# Altium schematic sheet Sheet5.SchDoc
size A4; SheetNumber: 5; SheetTotal: 6
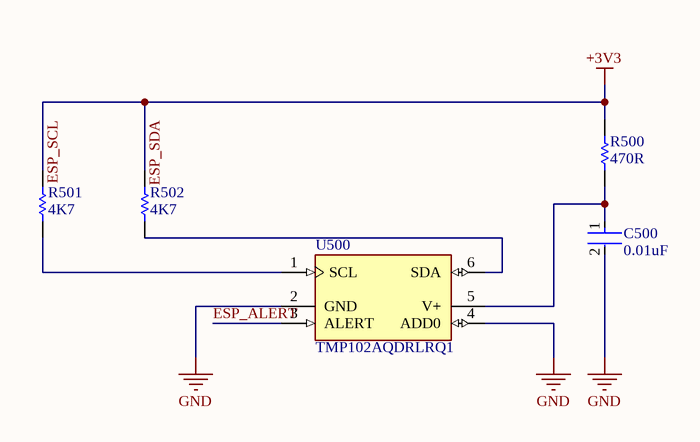
[diagram p0: Sheet5.SchDoc]

## Parts
C500  0.01uF  [FP-GRM155-0_05-IPC_C]
R500  470R  [RESC1005X40X25ML05T10]
R501  4K7  [RESC1005X40X25NL05T10]
R502  4K7  [RESC1005X40X25NL05T10]
U500  TMP102AQDRLRQ1  [FP-DRL0006A-MFG]

## Nets
ESP_SCL: R500.2 R501.2 R502.2  [also labelled +3V3, ESP_SDA]
GND: C500.2 U500.2(GND) U500.4(ADD0)
ESP_ALERT: U500.3(ALERT)
NetC500_1: C500.1 R500.1 U500.5(V+)
NetR501_1: R501.1 U500.1(SCL)
NetR502_1: R502.1 U500.6(SDA)

## Library data of the parts
C500 = CMP-2008-04637-5: Chip Multilayer Ceramic Capacitors for General Purpose, 0402, 10000pF, X7R, 15%, 10%, 50V; Voltage: 25V; Capacitance: 10nF; Tolerance: 10%; Mount: Surface Mount; Lead Free: Lead Free; Radiation Hardening: No; Case Code (Imperial): 0402; REACH SVHC: No SVHC; Case/Package: 0402; Dielectric: X7R; Voltage Rating (DC): 50V; Max Operating Temperature: 125°C; Termination: SMD/SMT; Material: Ceramic; Width: 0.02inch; Package Quantity: 1; Voltage Rating: 50V; Thickness: 0.022inch; Packaging: Tape and Reel; Height: 0.5mm; Number of Pins: 2; Case Code (Metric): 1005; Min Operating Temperature: -55°C; Length: 1mm; Depth: 0.5mm
R500 = CMP-2002-07697-1: Part Number: RC0402FR-07470RL; Manufacturer: Yageo / Phycomp
R501 R502 = CMP-1011-00586-2: Manufacturer: Yageo / Phycomp; Part Number: RC0402FR-074K7L
U500 = CMP-04948-000031-1: SENSOR DIGITAL -40C-125C 6SOT; Output Type: I2C; Operating Supply Voltage: 3.6V; Quiescent Current: 10uA; Resolution: 11b; Mount: Surface Mount; Max Operating Temperature: 125°C; Case/Package: SOT-563; Lead Free: Lead Free; Min Operating Temperature: -40°C; Packaging: Tape and Reel; Interface: I2C; Number of Pins: 6; RoHS Compliant: Yes